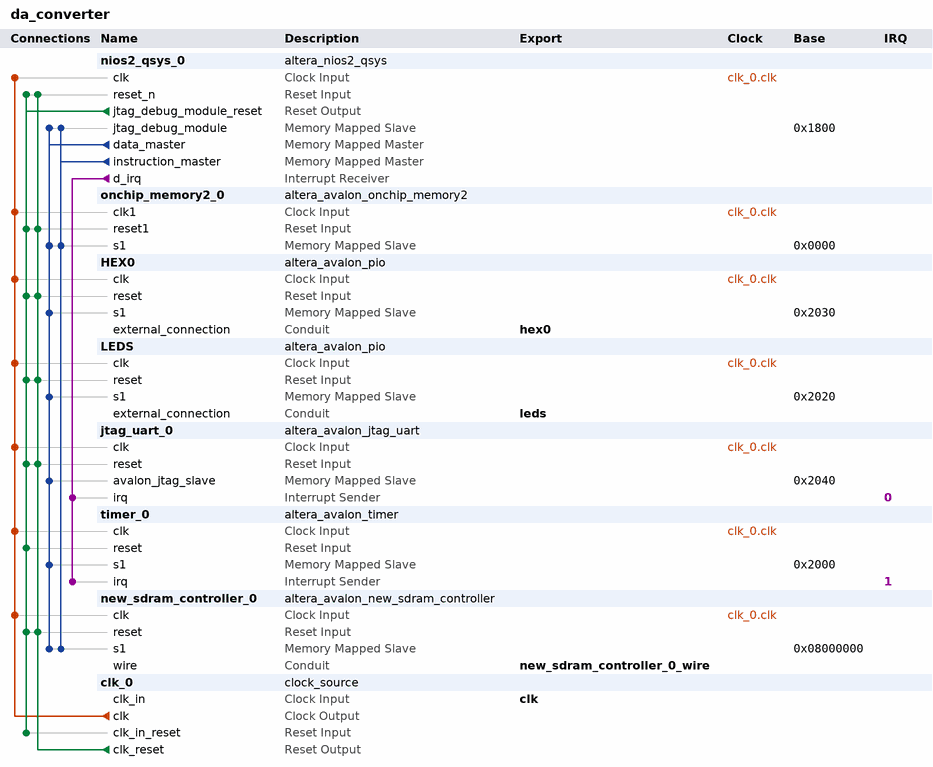
[diagram p0: system contents]
# Platform Designer (Qsys) system da_converter, Cyclone V 5CSEMA5F31C6
# Parameters at their usual value, and those the tool derives, are not listed.
package require -exact qsys 16.1
create_system da_converter
set_project_property DEVICE_FAMILY {Cyclone V}
set_project_property DEVICE 5CSEMA5F31C6

add_instance nios2_qsys_0 altera_nios2_qsys 16.1
set_instance_parameter_value nios2_qsys_0 breakSlave nios2_qsys_0.jtag_debug_module
set_instance_parameter_value nios2_qsys_0 exceptionSlave onchip_memory2_0.s1
set_instance_parameter_value nios2_qsys_0 icache_size 4096
set_instance_parameter_value nios2_qsys_0 impl Tiny
set_instance_parameter_value nios2_qsys_0 mmu_TLBMissExcSlave None
set_instance_parameter_value nios2_qsys_0 resetSlave onchip_memory2_0.s1
set_instance_parameter_value nios2_qsys_0 resetrequest_enabled true

add_instance onchip_memory2_0 altera_avalon_onchip_memory2 16.1
set_instance_parameter_value onchip_memory2_0 dataWidth 32
set_instance_parameter_value onchip_memory2_0 dualPort false
set_instance_parameter_value onchip_memory2_0 initMemContent true
set_instance_parameter_value onchip_memory2_0 initializationFileName onchip_mem.hex
set_instance_parameter_value onchip_memory2_0 memorySize 4096

add_instance HEX0 altera_avalon_pio 16.1
set_instance_parameter_value HEX0 direction Output
set_instance_parameter_value HEX0 width 8

add_instance LEDS altera_avalon_pio 16.1
set_instance_parameter_value LEDS direction Output
set_instance_parameter_value LEDS width 2

add_instance jtag_uart_0 altera_avalon_jtag_uart 16.1
set_instance_parameter_value jtag_uart_0 simInteractiveOptions NO_INTERACTIVE_WINDOWS

add_instance timer_0 altera_avalon_timer 16.1
set_instance_parameter_value timer_0 period 1
set_instance_parameter_value timer_0 periodUnits MSEC

add_instance new_sdram_controller_0 altera_avalon_new_sdram_controller 16.1
set_instance_parameter_value new_sdram_controller_0 TAC 5.5
set_instance_parameter_value new_sdram_controller_0 TRCD 20.0
set_instance_parameter_value new_sdram_controller_0 TRP 20.0
set_instance_parameter_value new_sdram_controller_0 casLatency 3
set_instance_parameter_value new_sdram_controller_0 columnWidth 8
set_instance_parameter_value new_sdram_controller_0 dataWidth 32
set_instance_parameter_value new_sdram_controller_0 generateSimulationModel false
set_instance_parameter_value new_sdram_controller_0 model single_Micron_MT48LC4M32B2_7_chip
set_instance_parameter_value new_sdram_controller_0 numberOfBanks 4
set_instance_parameter_value new_sdram_controller_0 numberOfChipSelects 1
set_instance_parameter_value new_sdram_controller_0 powerUpDelay 100.0
set_instance_parameter_value new_sdram_controller_0 refreshPeriod 15.625
set_instance_parameter_value new_sdram_controller_0 rowWidth 12

add_instance clk_0 clock_source 16.1
set_instance_parameter_value clk_0 clockFrequency 50000000

# connections
add_connection clk_0.clk HEX0.clk clock
add_connection clk_0.clk jtag_uart_0.clk clock
add_connection clk_0.clk LEDS.clk clock
add_connection clk_0.clk new_sdram_controller_0.clk clock
add_connection clk_0.clk nios2_qsys_0.clk clock
add_connection clk_0.clk onchip_memory2_0.clk1 clock
add_connection clk_0.clk timer_0.clk clock
add_connection clk_0.clk_reset HEX0.reset reset
add_connection clk_0.clk_reset jtag_uart_0.reset reset
add_connection clk_0.clk_reset LEDS.reset reset
add_connection clk_0.clk_reset new_sdram_controller_0.reset reset
add_connection clk_0.clk_reset nios2_qsys_0.reset_n reset
add_connection clk_0.clk_reset onchip_memory2_0.reset1 reset
add_connection nios2_qsys_0.jtag_debug_module_reset clk_0.clk_in_reset reset
add_connection nios2_qsys_0.jtag_debug_module_reset HEX0.reset reset
add_connection nios2_qsys_0.jtag_debug_module_reset jtag_uart_0.reset reset
add_connection nios2_qsys_0.jtag_debug_module_reset LEDS.reset reset
add_connection nios2_qsys_0.jtag_debug_module_reset new_sdram_controller_0.reset reset
add_connection nios2_qsys_0.jtag_debug_module_reset nios2_qsys_0.reset_n reset
add_connection nios2_qsys_0.jtag_debug_module_reset onchip_memory2_0.reset1 reset
add_connection nios2_qsys_0.jtag_debug_module_reset timer_0.reset reset
add_connection nios2_qsys_0.data_master HEX0.s1 avalon
set_connection_parameter_value nios2_qsys_0.data_master/HEX0.s1 baseAddress 0x2030
add_connection nios2_qsys_0.data_master jtag_uart_0.avalon_jtag_slave avalon
set_connection_parameter_value nios2_qsys_0.data_master/jtag_uart_0.avalon_jtag_slave baseAddress 0x2040
add_connection nios2_qsys_0.data_master LEDS.s1 avalon
set_connection_parameter_value nios2_qsys_0.data_master/LEDS.s1 baseAddress 0x2020
add_connection nios2_qsys_0.data_master new_sdram_controller_0.s1 avalon
set_connection_parameter_value nios2_qsys_0.data_master/new_sdram_controller_0.s1 baseAddress 0x08000000
add_connection nios2_qsys_0.data_master nios2_qsys_0.jtag_debug_module avalon
set_connection_parameter_value nios2_qsys_0.data_master/nios2_qsys_0.jtag_debug_module baseAddress 0x1800
add_connection nios2_qsys_0.data_master onchip_memory2_0.s1 avalon
set_connection_parameter_value nios2_qsys_0.data_master/onchip_memory2_0.s1 baseAddress 0x0000
add_connection nios2_qsys_0.data_master timer_0.s1 avalon
set_connection_parameter_value nios2_qsys_0.data_master/timer_0.s1 baseAddress 0x2000
add_connection nios2_qsys_0.instruction_master new_sdram_controller_0.s1 avalon
set_connection_parameter_value nios2_qsys_0.instruction_master/new_sdram_controller_0.s1 baseAddress 0x08000000
add_connection nios2_qsys_0.instruction_master nios2_qsys_0.jtag_debug_module avalon
set_connection_parameter_value nios2_qsys_0.instruction_master/nios2_qsys_0.jtag_debug_module baseAddress 0x1800
add_connection nios2_qsys_0.instruction_master onchip_memory2_0.s1 avalon
set_connection_parameter_value nios2_qsys_0.instruction_master/onchip_memory2_0.s1 baseAddress 0x0000
add_connection nios2_qsys_0.d_irq jtag_uart_0.irq interrupt
set_connection_parameter_value nios2_qsys_0.d_irq/jtag_uart_0.irq irqNumber 0
add_connection nios2_qsys_0.d_irq timer_0.irq interrupt
set_connection_parameter_value nios2_qsys_0.d_irq/timer_0.irq irqNumber 1

# exported interfaces
add_interface clk clock sink
set_interface_property clk EXPORT_OF clk_0.clk_in
add_interface hex0 conduit end
set_interface_property hex0 EXPORT_OF HEX0.external_connection
add_interface leds conduit end
set_interface_property leds EXPORT_OF LEDS.external_connection
add_interface new_sdram_controller_0_wire conduit end
set_interface_property new_sdram_controller_0_wire EXPORT_OF new_sdram_controller_0.wire

set_interconnect_requirement {$system} qsys_mm.clockCrossingAdapter HANDSHAKE
set_interconnect_requirement {$system} qsys_mm.enableEccProtection FALSE
set_interconnect_requirement {$system} qsys_mm.insertDefaultSlave FALSE
set_interconnect_requirement {$system} qsys_mm.maxAdditionalLatency 1

save_system da_converter.qsys
